# EAGLE design BSPD Tester (EAGLE 9.6.2)
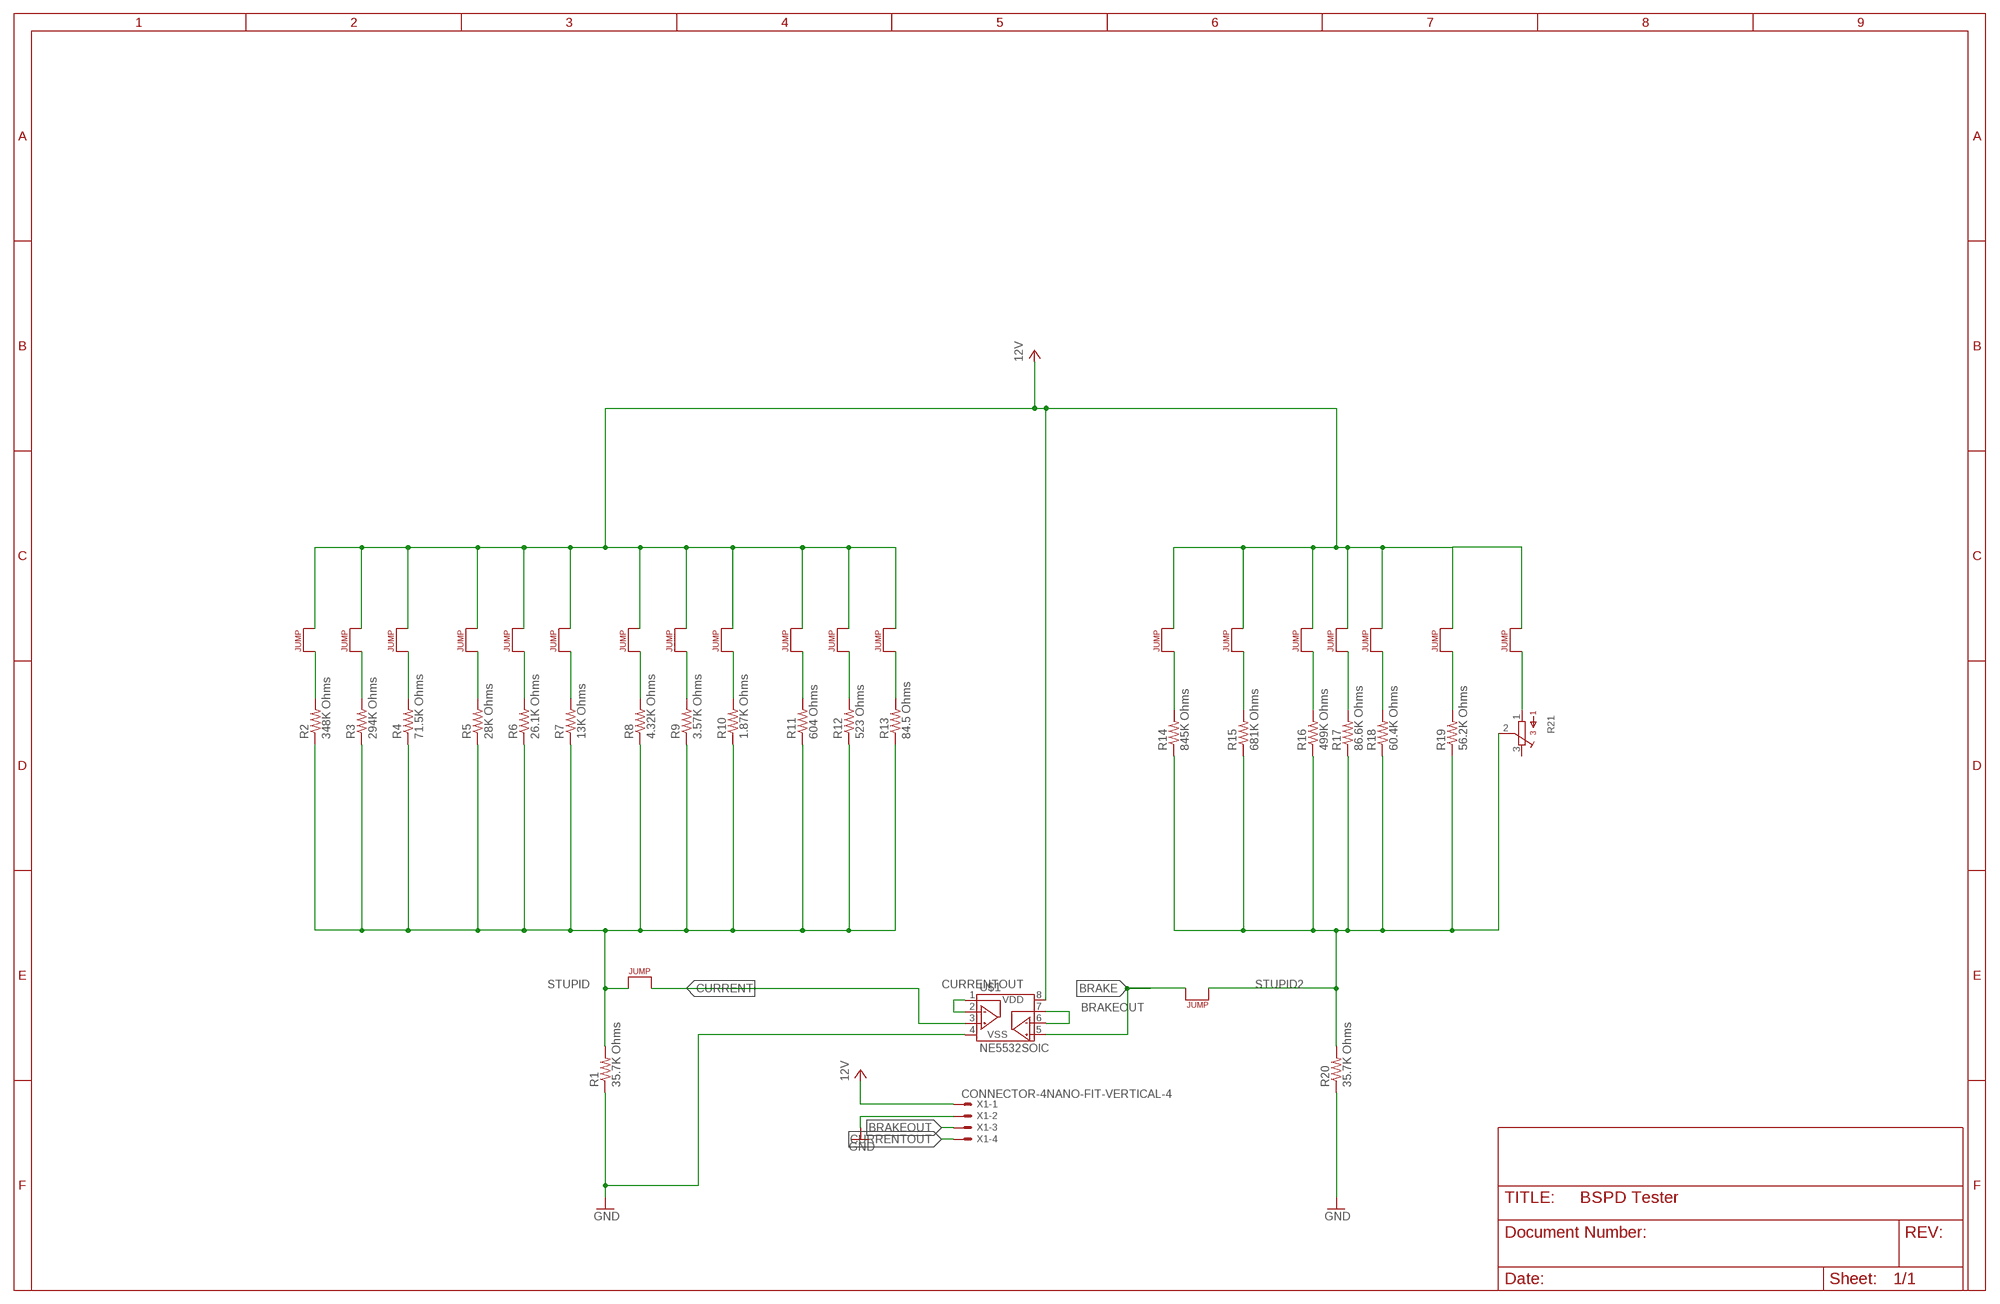
[diagram p0: schematic, sheet 1]

## Parts
J1  JUMPER.1  [1X02]
J2  JUMPER.1  [1X02]
J3  JUMPER.1  [1X02]
J4  JUMPER.1  [1X02]
J5  JUMPER.1  [1X02]
J6  JUMPER.1  [1X02]
J7  JUMPER.1  [1X02]
J8  JUMPER.1  [1X02]
J9  JUMPER.1  [1X02]
J10  JUMPER.1  [1X02]
J11  JUMPER.1  [1X02]
J12  JUMPER.1  [1X02]
J13  JUMPER.1  [1X02]
J14  JUMPER.1  [1X02]
J15  JUMPER.1  [1X02]
J16  JUMPER.1  [1X02]
J17  JUMPER.1  [1X02]
J18  JUMPER.1  [1X02]
J19  JUMPER.1  [1X02]
J20  JUMPER.1  [1X02]
J21  JUMPER.1  [1X02]
R1  35.7K Ohms  RESISTOR1206  [1206]
R2  348K Ohms  RESISTOR1206  [1206]
R3  294K Ohms  RESISTOR1206  [1206]
R4  71.5K Ohms  RESISTOR1206  [1206]
R5  28K Ohms  RESISTOR1206  [1206]
R6  26.1K Ohms  RESISTOR1206  [1206]
R7  13K Ohms  RESISTOR1206  [1206]
R8  4.32K Ohms  RESISTOR1206  [1206]
R9  3.57K Ohms  RESISTOR1206  [1206]
R10  1.87K Ohms  RESISTOR1206  [1206]
R11  604 Ohms  RESISTOR1206  [1206]
R12  523 Ohms  RESISTOR1206  [1206]
R13  84.5 Ohms  RESISTOR1206  [1206]
R14  845K Ohms  RESISTOR1206  [1206]
R15  681K Ohms  RESISTOR1206  [1206]
R16  499K Ohms  RESISTOR1206  [1206]
R17  86.6K Ohms  RESISTOR1206  [1206]
R18  60.4K Ohms  RESISTOR1206  [1206]
R19  56.2K Ohms  RESISTOR1206  [1206]
R20  35.7K Ohms  RESISTOR1206  [1206]
R21  TRIMPOT_3296C  [TRIMPOT_3296]
U$1  NE5532SOIC  [SOIC-08]
X1  CONNECTOR-4NANO-FIT-VERTICAL-4  [NANO-FIT_VERTICAL-4]

## Nets
BRAKE: J21.2 U$1.5(VINB+)
BRAKEOUT: U$1.6(VINB-) U$1.7(VOUTB) X1.P$3
CURRENT: J19.2 U$1.3(VINA+)
CURRENTOUT: U$1.1(VOUTA) U$1.2(VINA-) X1.P$4
GND: R1.1 R20.1 U$1.4(VSS) X1.P$2
N$1: J1.1 R2.2
N$2: J13.1 R14.2
N$3: J2.1 R3.2
N$4: J3.1 R4.2
N$5: J4.1 R5.2
N$6: J5.1 R6.2
N$7: J6.1 R7.2
N$8: J7.1 R8.2
N$9: J8.1 R9.2
N$10: J9.1 R10.2
N$11: J10.1 R11.2
N$12: J11.1 R12.2
N$13: J12.1 R13.2
N$14: J14.1 R15.2
N$15: J15.1 R16.2
N$16: J16.1 R17.2
N$17: J17.1 R18.2
N$18: J18.1 R19.2
N$20: J20.1 R21.1
STUPID: J19.1 R1.2 R2.1 R3.1 R4.1 R5.1 R6.1 R7.1 R8.1 R9.1 R10.1 R11.1 R12.1 R13.1
STUPID2: J21.1 R14.1 R15.1 R16.1 R17.1 R18.1 R19.1 R20.2 R21.2
VCC: J1.2 J2.2 J3.2 J4.2 J5.2 J6.2 J7.2 J8.2 J9.2 J10.2 J11.2 J12.2 J13.2 J14.2 J15.2 J16.2 J17.2 J18.2 J20.2 U$1.8(VDD) X1.P$1 ; supply symbol labelled 12V
Unconnected: R21.3

## Library data of the parts
J1-J21 = HyTechDevices:JUMPER: Jumper for changing operation of a device
R1-R20 = HyTechDevices:RESISTOR: Resistor Basic schematic elements and footprints for 0603, 1206, and PTH resistors.
R21 = HyTechDevices:TRIMPOT_3296: 3296 Series 3/8" Square Trimmer Source <https://github.com/chiengineer/Eagle-Libraries/blob/master/Potentiometers/bourns.lbr>
U$1 = HyTechDevices:NE5532: TI NE5532 Dual Channel Op Amp
X1 = HyTechDevices:CONNECTOR-4: Mini-Fit Junior connector 4 pole Source: http://www.molex.com

## Board
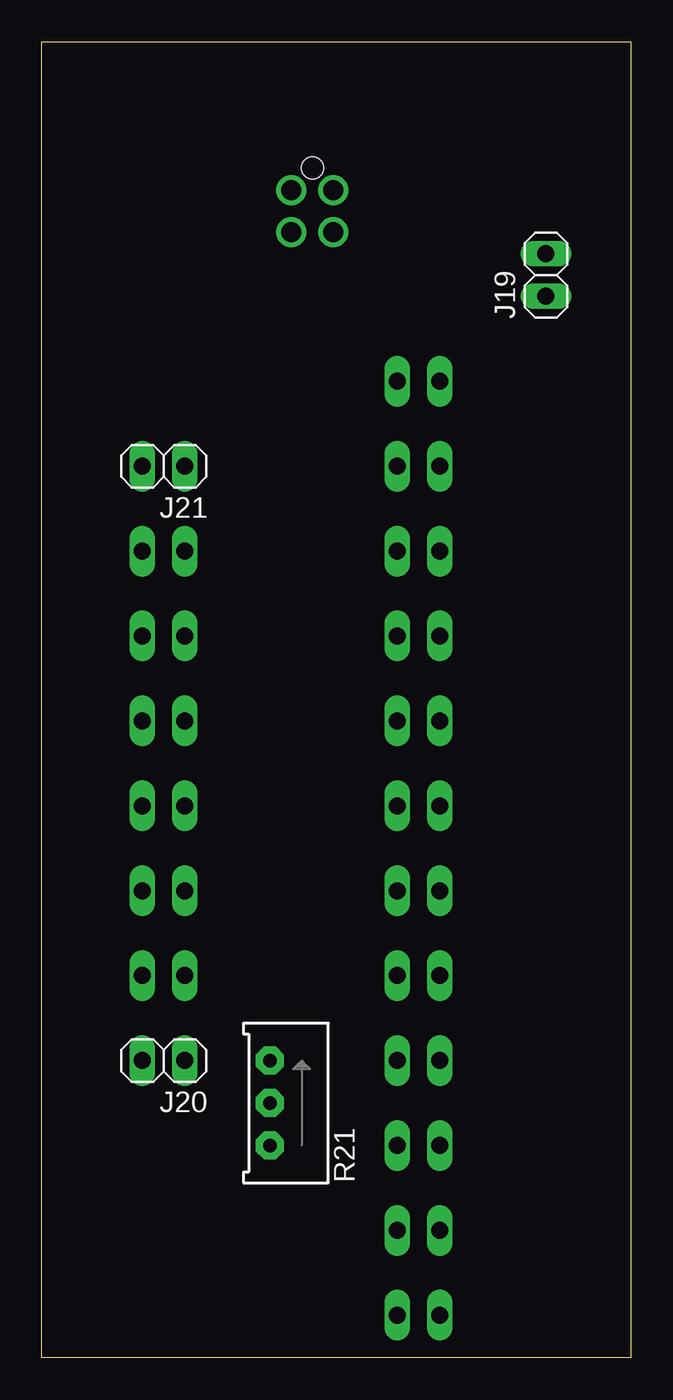
[diagram p1: board, top side]
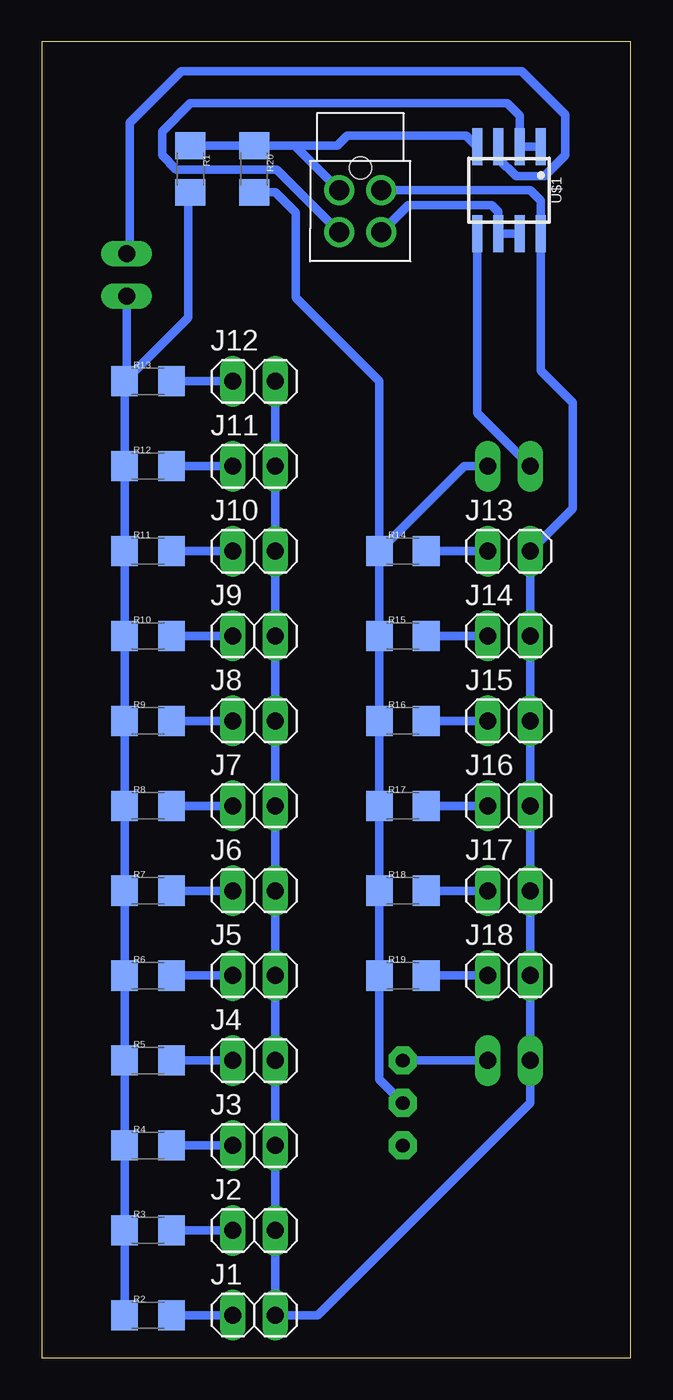
[diagram p2: board, bottom side, seen from below]

Size 35.23 x 78.73 mm. Coordinates in mm from the lower left corner, seen from the top.
Outline: 35.23,0 0,0 0,78.73 35.23,78.73 35.23,0
Copper layers (1*16): Top 0.035mm / dielectric 1.5mm / Bottom 0.035mm
Design rules "default": minimum track width 6mil, minimum drill 0.35mm, track to track 6mil, track to pad 6mil, pad to pad 6mil, via to via 6mil, smd to smd 6mil, copper to edge 40mil, drill to drill 6mil, minimum pad ring 10mil, minimum via ring 8mil, stop-mask expansion 4mil, vias tented up to drill 0mil, thermal gap 10mil

### Footprints (pad centres in the part's own frame; a part is rotated, then mirrored left to right if it is on the bottom)
1X02 = drill 1.016 long: 1 -1.27,0; 2 1.27,0
1206 = smd 1.6 x 1.8: 1 -1.4,0; 2 1.4,0
TRIMPOT_3296 = drill 0.813 pad 1.676 octagon: 1 2.54,1.27; 2 0,1.27; 3 -2.54,1.27
SOIC-08 = smd 0.6 x 2.2: 1 -1.905,-2.6; 2 -0.635,-2.6; 3 0.635,-2.6; 4 1.905,-2.6; 5 1.905,2.6; 6 0.635,2.6; 7 -0.635,2.6; 8 -1.905,2.6
NANO-FIT_VERTICAL-4 = drill 1.2: P$1 -1.25,0; P$2 1.25,0; P$3 -1.25,2.5; P$4 1.25,2.5 | hole 1.3: 0,-1.34

### Placement (x,y rotation side)
J1  22.53,2.54 0 bottom
J2  22.53,7.62 0 bottom
J3  22.53,12.7 0 bottom
J4  22.53,17.78 0 bottom
J5  22.53,22.86 0 bottom
J6  22.53,27.94 0 bottom
J7  22.53,33.02 0 bottom
J8  22.53,38.1 0 bottom
J9  22.53,43.18 0 bottom
J10  22.53,48.26 0 bottom
J11  22.53,53.34 0 bottom
J12  22.53,58.42 0 bottom
J13  7.29,48.26 0 bottom
J14  7.29,43.18 0 bottom
J15  7.29,38.1 0 bottom
J16  7.29,33.02 0 bottom
J17  7.29,27.94 0 bottom
J18  7.29,22.86 0 bottom
J19  30.15,64.77 90 top
J20  7.29,17.78 180 top
J21  7.29,53.34 180 top
R1  26.34,71.12 270 bottom
R2  28.88,2.54 0 bottom
R3  28.88,7.62 0 bottom
R4  28.88,12.7 0 bottom
R5  28.88,17.78 0 bottom
R6  28.88,22.86 0 bottom
R7  28.88,27.94 0 bottom
R8  28.88,33.02 0 bottom
R9  28.88,38.1 0 bottom
R10  28.88,43.18 0 bottom
R11  28.88,48.26 0 bottom
R12  28.88,53.34 0 bottom
R13  28.88,58.42 0 bottom
R14  13.64,48.26 0 bottom
R15  13.64,43.18 0 bottom
R16  13.64,38.1 0 bottom
R17  13.64,33.02 0 bottom
R18  13.64,27.94 0 bottom
R19  13.64,22.86 0 bottom
R20  22.53,71.12 270 bottom
R21  14.91,15.24 90 top
U$1  7.29,69.85 180 bottom
X1  16.18,69.85 180 bottom

### Tracks (layer width: path | path; a pad name or v marks a point on that pad's centre or on a via)
BRAKE
  Bottom 0.508: U$1.5 9.2,56.52 J21.2
BRAKEOUT
  Bottom 0.508: X1.P$3 13.32,68.96 8.31,68.96 7.92,68.58 U$1.6 U$1.7
CURRENT
  Bottom 0.508: J19.2 29.96,66.23 29.96,73.89 26.88,76.97 6.53,76.97 3.92,74.35 3.92,71.94 5.17,70.69 6.87,70.69 7.92,71.75 U$1.3
CURRENTOUT
  Bottom 0.508: U$1.1 U$1.2 6.66,74.3 7.4,75.04 26.35,75.04 28.03,73.36 28.03,71.93 27.18,71.08 21.16,71.08 X1.P$4
GND
  Bottom 0.508: X1.P$2 20.1,72.52 | 20.1,72.52 R20.1 R1.1 | 20.1,72.52 17.56,72.52 16.98,73.11 9.86,73.11 U$1.4
N$1
  Bottom 0.508: R2.2 J1.1
N$2
  Bottom 0.508: R14.2 J13.1
N$3
  Bottom 0.508: R3.2 J2.1
N$4
  Bottom 0.508: R4.2 J3.1
N$5
  Bottom 0.508: R5.2 J4.1
N$6
  Bottom 0.508: R6.2 J5.1
N$7
  Bottom 0.508: R7.2 J6.1
N$8
  Bottom 0.508: R8.2 J7.1
N$9
  Bottom 0.508: R9.2 J8.1
N$10
  Bottom 0.508: R10.2 J9.1
N$11
  Bottom 0.508: R11.2 J10.1
N$12
  Bottom 0.508: R12.2 J11.1
N$13
  Bottom 0.508: R13.2 J12.1
N$14
  Bottom 0.508: J14.1 R15.2
N$15
  Bottom 0.508: R16.2 J15.1
N$16
  Bottom 0.508: J16.1 R17.2
N$17
  Bottom 0.508: R18.2 J17.1
N$18
  Bottom 0.508: J18.1 R19.2
N$20
  Bottom 0.508: R21.1 J20.1
STUPID
  Bottom 0.508: R1.2 26.47,69.59 26.47,62.23 R13.1 | R2.1 R3.1 R4.1 R5.1 R6.1 R7.1 R8.1 R9.1 R10.1 R11.1 R12.1 R13.1 | R13.1 30.15,58.55 J19.1
STUPID2
  Bottom 0.508: R20.2 21.26,69.72 20.05,68.52 20.05,63.44 15.04,58.42 R14.1 | J21.1 9.96,53.34 R14.1 | R21.2 15.04,16.64 R19.1 R18.1 R17.1 R16.1 R15.1 R14.1
VCC
  Bottom 0.508: J12.2 J11.2 J10.2 J9.2 J8.2 J7.2 J6.2 J5.2 J4.2 J3.2 J2.2 J1.2 18.72,2.54 6.02,15.24 J20.2 J18.2 J17.2 J16.2 J15.2 J14.2 J13.2 3.48,50.8 3.48,57.15 5.38,59.06 U$1.8 5.38,69.22 6.02,69.85 X1.P$1